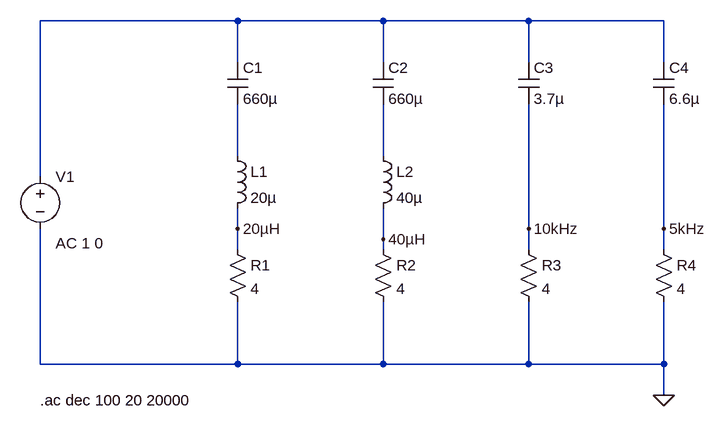
[diagram p0: schematic passive-crossover.asc]
passive-crossover.asc, the LTspice schematic file:
Version 4
SHEET 1 908 680
WIRE 176 64 -128 64
WIRE 400 64 176 64
WIRE 624 64 400 64
WIRE 832 64 624 64
WIRE 176 128 176 64
WIRE 400 128 400 64
WIRE 624 128 624 64
WIRE 832 128 832 64
WIRE 176 272 176 192
WIRE 400 272 400 192
WIRE -128 304 -128 64
WIRE 176 384 176 352
WIRE 624 384 624 192
WIRE 832 384 832 192
WIRE 400 400 400 352
WIRE 176 416 176 384
WIRE 400 416 400 400
WIRE 624 416 624 384
WIRE 832 416 832 384
WIRE -128 592 -128 384
WIRE 176 592 176 496
WIRE 176 592 -128 592
WIRE 400 592 400 496
WIRE 400 592 176 592
WIRE 624 592 624 496
WIRE 624 592 400 592
WIRE 832 592 832 496
WIRE 832 592 624 592
WIRE 832 640 832 592
FLAG 832 640 0
FLAG 176 384 20µH
FLAG 400 400 40µH
FLAG 624 384 10kHz
FLAG 832 384 5kHz
SYMBOL voltage -128 288 R0
WINDOW 3 24 96 Invisible 2
WINDOW 123 24 118 Left 2
SYMATTR InstName V1
SYMATTR Value SINE(0 1)
SYMATTR Value2 AC 1 0
SYMBOL cap 160 128 R0
SYMATTR InstName C1
SYMATTR Value 660µ
SYMBOL cap 384 128 R0
SYMATTR InstName C2
SYMATTR Value 660µ
SYMBOL cap 608 128 R0
SYMATTR InstName C3
SYMATTR Value 3.7µ
SYMBOL cap 816 128 R0
SYMATTR InstName C4
SYMATTR Value 6.6µ
SYMBOL res 160 400 R0
SYMATTR InstName R1
SYMATTR Value 4
SYMBOL res 384 400 R0
SYMATTR InstName R2
SYMATTR Value 4
SYMBOL res 608 400 R0
SYMATTR InstName R3
SYMATTR Value 4
SYMBOL res 816 400 R0
SYMATTR InstName R4
SYMATTR Value 4
SYMBOL ind 160 256 R0
SYMATTR InstName L1
SYMATTR Value 20µ
SYMBOL ind 384 256 R0
SYMATTR InstName L2
SYMATTR Value 40µ
TEXT -128 648 Left 2 !.ac dec 100 20 20000

The netlist it stands for:
* passive-crossover.asc
V1 N001 0 SINE(0 1) AC 1 0
C1 N001 N002 660µ
C2 N001 N003 660µ
C3 N001 10kHz 3.7µ
C4 N001 5kHz 6.6µ
R1 20µH 0 4
R2 40µH 0 4
R3 10kHz 0 4
R4 5kHz 0 4
L1 N002 20µH 20µ
L2 N003 40µH 40µ
.ac dec 100 20 20000
.backanno
.end